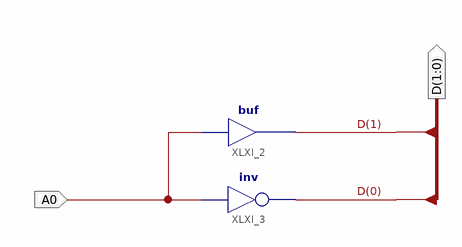
[diagram p0: schematic sheet 1]
// Xilinx ISE schematic Dec1_2.sch (spartan6) as structural Verilog: 2 symbols, 2 ports
module Dec1_2 (
  input  A0,
  output [1:0] D
);

  buf XLXI_2 (D[1], A0);
  not XLXI_3 (D[0], A0);
endmodule
